# EAGLE schematic Arduino-Mega-Shield-EAGLE (EAGLE 9.2.2)
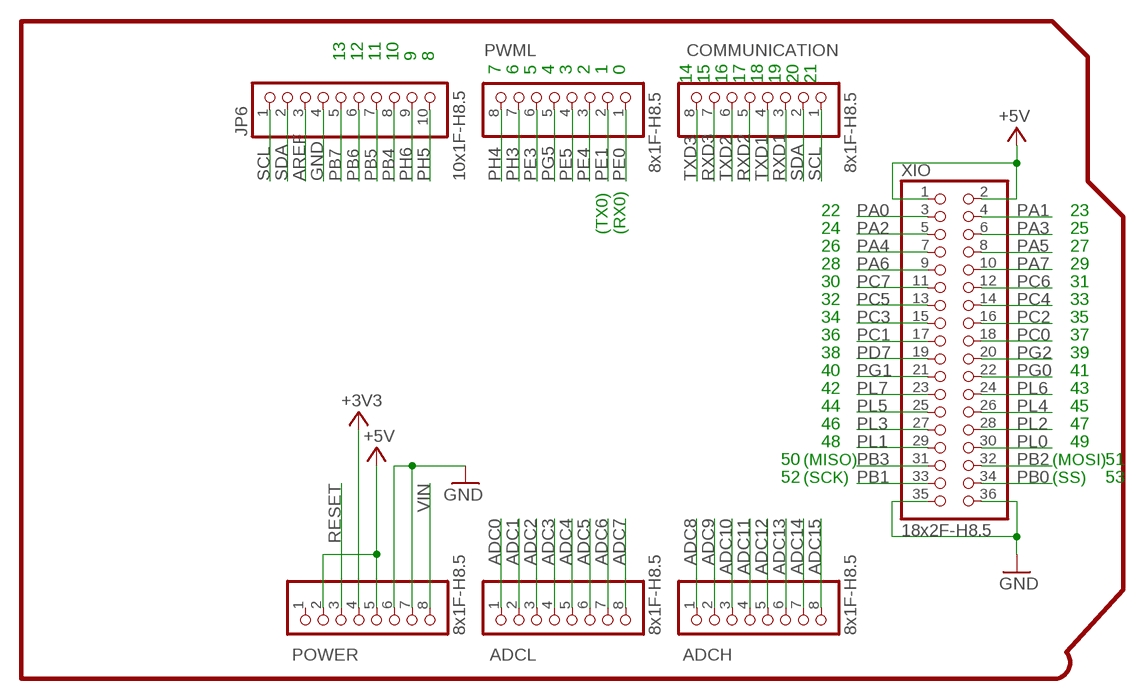
[diagram p0: schematic, sheet 1]

## Parts
ADCH  8x1F-H8.5  PINHD-1X8  [1X08]
ADCL  8x1F-H8.5  PINHD-1X8  [1X08]
COMMUNICATION  8x1F-H8.5  PINHD-1X8  [1X08]
JP6  10x1F-H8.5  PINHD-1X10_ARD  [1X10]
POWER  8x1F-H8.5  PINHD-1X8  [1X08]
PWML  8x1F-H8.5  PINHD-1X8  [1X08]
XIO  18x2F-H8.5  PINHD-2X18  [2X18]

## Nets
+3V3 [power]: POWER.4
+5V [power usb]: POWER.2 POWER.5 XIO.1 XIO.2
ADC0: ADCL.1
ADC1: ADCL.2
ADC2: ADCL.3
ADC3: ADCL.4
ADC4: ADCL.5
ADC5: ADCL.6
ADC6: ADCL.7
ADC7: ADCL.8
ADC8: ADCH.1
ADC9: ADCH.2
ADC10: ADCH.3
ADC11: ADCH.4
ADC12: ADCH.5
ADC13: ADCH.6
ADC14: ADCH.7
ADC15: ADCH.8
AREF: JP6.3
GND [gnd]: JP6.4 POWER.6 POWER.7 XIO.35 XIO.36
PA0: XIO.3
PA1: XIO.4
PA2: XIO.5
PA3: XIO.6
PA4: XIO.7
PA5: XIO.8
PA6: XIO.9
PA7: XIO.10
PB0: XIO.34
PB1: XIO.33
PB2: XIO.32
PB3: XIO.31
PB4: JP6.8
PB5: JP6.7
PB6: JP6.6
PB7: JP6.5
PC0: XIO.18
PC1: XIO.17
PC2: XIO.16
PC3: XIO.15
PC4: XIO.14
PC5: XIO.13
PC6: XIO.12
PC7: XIO.11
PD7: XIO.19
PE0: PWML.1
PE1: PWML.2
PE3: PWML.6
PE4: PWML.3
PE5: PWML.4
PG0: XIO.22
PG1: XIO.21
PG2: XIO.20
PG5: PWML.5
PH3: PWML.7
PH4: PWML.8
PH5: JP6.10
PH6: JP6.9
PL0: XIO.30
PL1: XIO.29
PL2: XIO.28
PL3: XIO.27
PL4: XIO.26
PL5: XIO.25
PL6: XIO.24
PL7: XIO.23
RESET: POWER.3
RXD1: COMMUNICATION.3
RXD2: COMMUNICATION.5
RXD3: COMMUNICATION.7
SCL: COMMUNICATION.1 JP6.1
SDA: COMMUNICATION.2 JP6.2
TXD1: COMMUNICATION.4
TXD2: COMMUNICATION.6
TXD3: COMMUNICATION.8
VIN [power]: POWER.8
Unconnected: POWER.1

## Notes on the sheet
- 13 | 12 | 11 | 10 | 9 | 8
- 7 | 6 | 5 | 4 | 3 | 2 | 1 | 0
- 14 | 15 | 16 | 17 | 18 | 19 | 20 | 21
- 22 | 23
- (TX0) | (RX0) | 24 | 25
- 26 | 27
- 28 | 29
- 30 | 31
- 32 | 33
- 34 | 35
- 36 | 37
- 38 | 39
- 40 | 41
- 42 | 43
- 44 | 45
- 46 | 47
- 48 | 49
- 50 | (MISO) | (MOSI) | 51
- 52 | (SCK) | (SS) | 53

## Library data of the parts
ADCH ADCL COMMUNICATION POWER PWML = SmartPrj:PINHD-1X8: PIN HEADER
JP6 = SmartPrj:PINHD-1X10_ARD: PIN HEADER
XIO = SmartPrj:PINHD-2X18: PIN HEADER

## Net classes
0 default: width 0.203 mm, drill 0.406 mm, clearance 0.203 mm
1 power: width 0.61 mm, drill 0.406 mm, clearance 0.203 mm
2 gnd: width 0.305 mm, drill 0.406 mm, clearance 0.203 mm
3 power usb: width 0.508 mm, drill 0.406 mm, clearance 0.203 mm